# Altium schematic sheet Reguladores.SchDoc
size A4
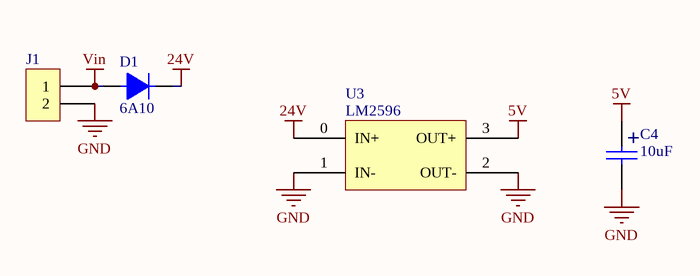
[diagram p0: Reguladores.SchDoc]

## Parts
C4  10uF  [CAP.ELEC]
D1  6A10  [DO214AC]
J1  BORNERA 2  [BORNERA2]  (value not drawn)
U3  LM2596  [LM2596 DC TO DC CONVERTER MODULE]

## Nets
5V: C4.1 U3.3(OUT+)
24V: D1.2 U3.0(IN+)
GND: C4.2 J1.2 U3.1(IN-) U3.2(OUT-)
Vin: D1.1 J1.1

## Notes on the sheet
- (in symbol CAPPOL) +

## Library data of the parts
C4 = CAPPOL
D1 = DIODO